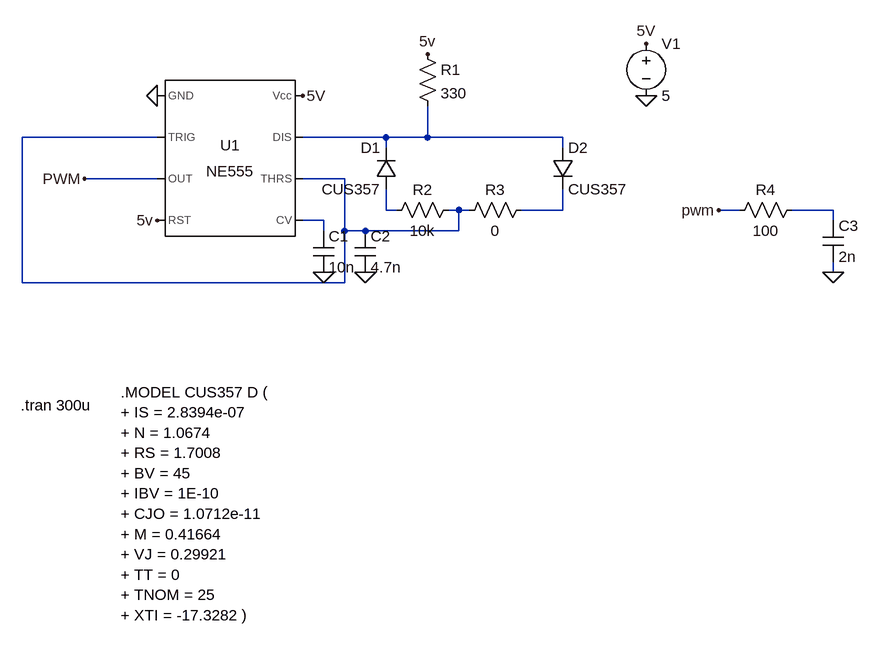
[diagram p0: schematic PWM.asc]
PWM.asc, the LTspice schematic file:
Version 4
SHEET 1 1224 796
WIRE 144 80 -64 80
WIRE 496 80 368 80
WIRE 560 80 560 32
WIRE 560 80 496 80
WIRE 768 80 560 80
WIRE 496 96 496 80
WIRE 768 96 768 80
WIRE 144 144 32 144
WIRE 432 144 368 144
WIRE 496 192 496 160
WIRE 512 192 496 192
WIRE 608 192 592 192
WIRE 624 192 608 192
WIRE 768 192 768 160
WIRE 768 192 704 192
WIRE 1040 192 1008 192
WIRE 1184 192 1120 192
WIRE 400 208 368 208
WIRE 1184 208 1184 192
WIRE 400 224 400 208
WIRE 432 224 432 144
WIRE 464 224 432 224
WIRE 608 224 608 192
WIRE 608 224 464 224
WIRE 1184 288 1184 272
WIRE -64 304 -64 80
WIRE 432 304 432 224
WIRE 432 304 -64 304
FLAG 144 16 0
FLAG 32 144 PWM
FLAG 896 16 0
FLAG 896 -64 5V
FLAG 368 16 5V
FLAG 400 288 0
FLAG 464 288 0
FLAG 560 -48 5v
FLAG 1184 288 0
FLAG 1008 192 pwm
FLAG 144 208 5v
SYMBOL Misc\\NE555 256 112 R0
SYMATTR InstName U1
SYMBOL cap 384 224 R0
SYMATTR InstName C1
SYMATTR Value 10n
SYMBOL cap 448 224 R0
SYMATTR InstName C2
SYMATTR Value 4.7n
SYMBOL voltage 896 -80 R0
WINDOW 123 0 0 Left 0
WINDOW 39 0 0 Left 0
SYMATTR InstName V1
SYMATTR Value 5
SYMBOL diode 512 160 R180
WINDOW 0 24 64 Left 2
WINDOW 3 24 0 Left 2
SYMATTR InstName D1
SYMATTR Value CUS357
SYMBOL diode 752 96 R0
SYMATTR InstName D2
SYMATTR Value CUS357
SYMBOL res 544 -64 R0
SYMATTR InstName R1
SYMATTR Value 330
SYMBOL res 608 176 R90
WINDOW 0 0 56 VBottom 2
WINDOW 3 32 56 VTop 2
SYMATTR InstName R2
SYMATTR Value 10k
SYMBOL res 720 176 R90
WINDOW 0 0 56 VBottom 2
WINDOW 3 32 56 VTop 2
SYMATTR InstName R3
SYMATTR Value 0
SYMBOL cap 1168 208 R0
SYMATTR InstName C3
SYMATTR Value 2n
SYMBOL res 1136 176 R90
WINDOW 0 0 56 VBottom 2
WINDOW 3 32 56 VTop 2
SYMATTR InstName R4
SYMATTR Value 100
TEXT 88 472 Left 2 !.MODEL CUS357 D (\n+ IS = 2.8394e-07\n+ N = 1.0674\n+ RS = 1.7008\n+ BV = 45\n+ IBV = 1E-10\n+ CJO = 1.0712e-11\n+ M = 0.41664\n+ VJ = 0.29921\n+ TT = 0\n+ TNOM = 25\n+ XTI = -17.3282 )
TEXT -66 492 Left 2 !.tran 300u

The netlist it stands for:
* PWM.asc
XU1 0 N001 PWM 5V N006 N001 N002 5V NE555  ; pins GND TRIG OUT RST CV THRS DIS Vcc
C1 N006 0 10n
C2 N001 0 4.7n
V1 5V 0 5
D1 N003 N002 CUS357
D2 N002 N004 CUS357
R1 5V N002 330
R2 N001 N003 10k
R3 N004 N001 0
C3 N005 0 2n
R4 N005 PWM 100
.model D D
.lib standard.dio
.MODEL CUS357 D (
+ IS = 2.8394e-07
+ N = 1.0674
+ RS = 1.7008
+ BV = 45
+ IBV = 1E-10
+ CJO = 1.0712e-11
+ M = 0.41664
+ VJ = 0.29921
+ TT = 0
+ TNOM = 25
+ XTI = -17.3282 )
.tran 300u
.lib NE555.sub
.backanno
.end